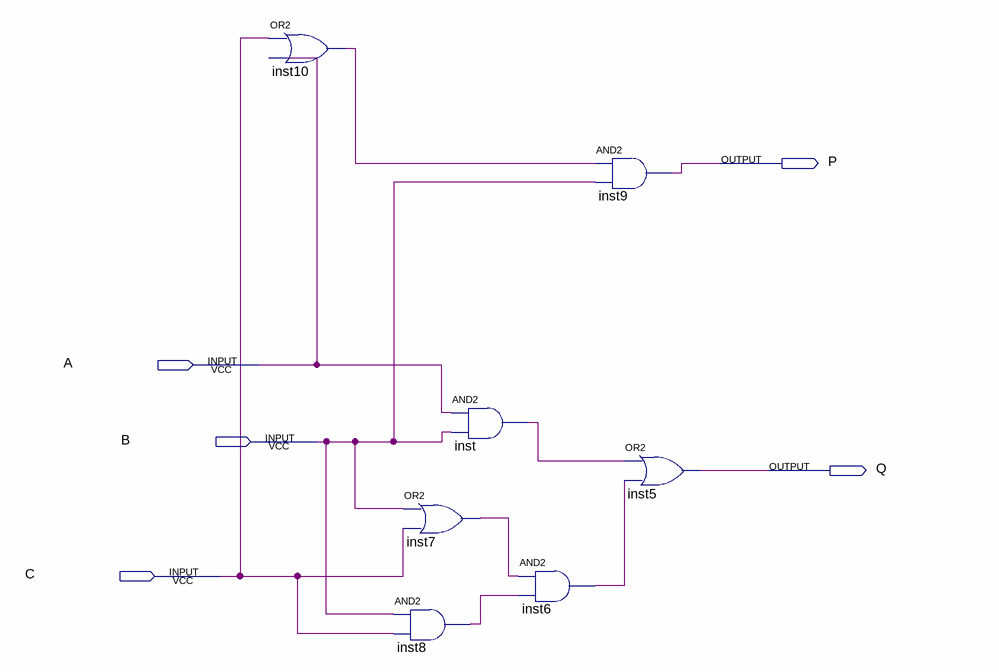
[diagram p0: schematic sheet]
// Quartus schematic ProjetoAula1.bdf as structural Verilog: 7 symbols, 5 pins
module ProjetoAula1 (
  input  A,
  input  B,
  input  C,
  output P,
  output Q
);

  wire inst6_out, inst7_out, inst8_out, inst10_out, inst_out;

  or inst10 (inst10_out, C, A);
  and inst (inst_out, A, B);
  or inst7 (inst7_out, B, C);
  and inst8 (inst8_out, B, C);
  and inst6 (inst6_out, inst7_out, inst8_out);
  and inst9 (P, inst10_out, B);
  or inst5 (Q, inst_out, inst6_out);
endmodule
